# EAGLE design DAMAVA_0 (EAGLE 8.2.2)
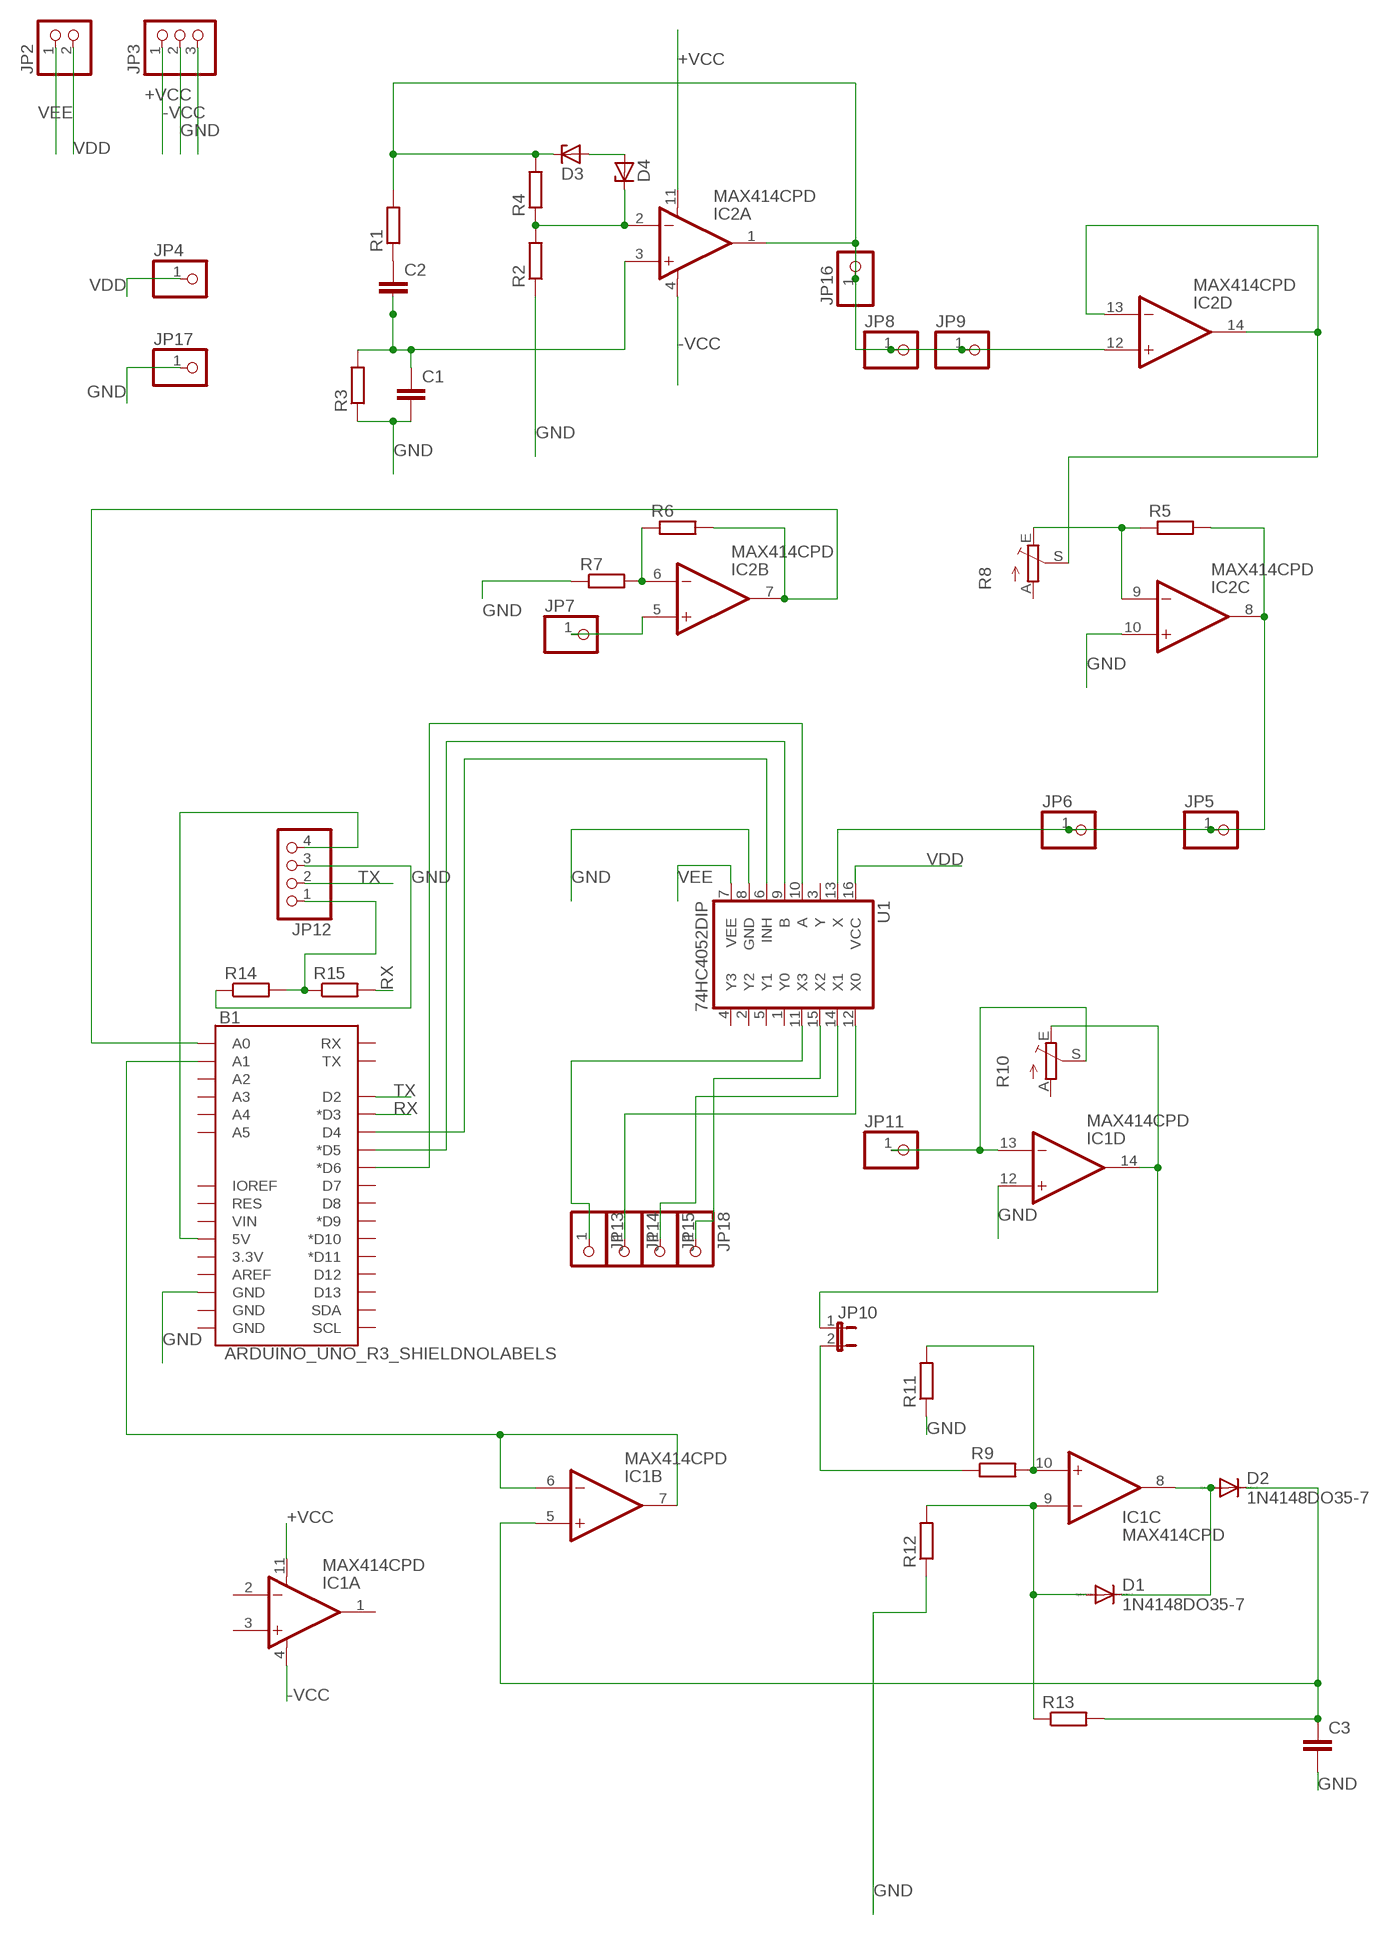
[diagram p0: schematic, sheet 1]

## Parts
B1  ARDUINO_UNO_R3_SHIELDNOLABELS  [UNO_R3_SHIELD_NOLABELS]
C1  C-EU025-024X044  [C025-024X044]
C2  C-EU025-024X044  [C025-024X044]
C3  C5/2.5  [C5B2.5]
D1  1N4148DO35-7  [DO35-7]
D2  1N4148DO35-7  [DO35-7]
D3  ZENER-DIODEZD-5  [ZDIO-5]
D4  ZENER-DIODEZD-5  [ZDIO-5]
IC1  MAX414CPD  [DIL14]
IC2  MAX414CPD  [DIL14]
JP2  PINHD-1X2  [1X02]
JP3  PINHD-1X3  [1X03]
JP4  PINHD-1X1  [1X01]
JP5  PINHD-1X1  [1X01]
JP6  PINHD-1X1  [1X01]
JP7  PINHD-1X1  [1X01]
JP8  PINHD-1X1  [1X01]
JP9  PINHD-1X1  [1X01]
JP10  JP1E  [JP1]
JP11  PINHD-1X1  [1X01]
JP12  PINHD-1X4  [1X04]
JP13  PINHD-1X1  [1X01]
JP14  PINHD-1X1  [1X01]
JP15  PINHD-1X1  [1X01]
JP16  PINHD-1X1  [1X01]
JP17  PINHD-1X1  [1X01]
JP18  PINHD-1X1  [1X01]
R1  R-EU_0204/5  [0204/5]
R2  R-EU_0204/5  [0204/5]
R3  R-EU_0204/5  [0204/5]
R4  R-EU_0204/5  [0204/5]
R5  R-EU_0204/5  [0204/5]
R6  R-EU_0204/5  [0204/5]
R7  R-EU_0204/5  [0204/5]
R8  TRIM_EU-B90P  [SP19L]
R9  R-EU_0204/5  [0204/5]
R10  TRIM_EU-B90P  [SP19L]
R11  R-EU_0204/5  [0204/5]
R12  R-EU_0204/5  [0204/5]
R13  R-EU_0204/5  [0204/5]
R14  R-EU_0204/5  [0204/5]
R15  R-EU_0204/5  [0204/5]
U1  74HC4052DIP  [DIL16]

## Nets
+VCC: IC1.11(A:V-) IC2.11(A:V-) JP3.1
-VCC: IC1.4(A:V+) IC2.4(A:V+) JP3.2
GND: B1.GND@2(GND) C1.2 C3.2 IC1.12(D:+IN) IC2.10(C:+IN) JP3.3 JP12.3 JP17.1 R2.1 R3.1 R7.1 R11.1 R12.1 R14.1 U1.8(GND)
N$1: C2.1 R1.1
N$2: C1.1 C2.2 IC2.3(A:+IN) R3.2
N$3: B1.D6(*D6) U1.10(A)
N$4: D4.C IC2.2(A:-IN) R2.2 R4.1
N$5: D3.C IC2.1(A:OUT) IC2.12(D:+IN) JP8.1 JP9.1 JP16.1 R1.2 R4.2
N$6: C3.1 D2.C IC1.5(B:+IN) R13.2
N$7: IC2.9(C:-IN) R5.1 R8.E
N$8: B1.D5(*D5) U1.9(B)
N$9: IC2.6(B:-IN) R6.1 R7.2
N$10: B1.A0 IC2.7(B:OUT) R6.2
N$11: IC2.5(B:+IN) JP7.1
N$12: B1.D4 U1.6(INH)
N$13: JP14.1 U1.12(X0)
N$14: JP15.1 U1.14(X1)
N$16: JP13.1 U1.11(X3)
N$17: IC1.13(D:-IN) JP11.1 R10.S
N$18: JP18.1 U1.15(X2)
N$19: B1.A1 IC1.6(B:-IN) IC1.7(B:OUT)
N$22: IC1.14(D:OUT) JP10.1 R10.E
N$23: IC1.10(C:+IN) R9.2 R11.2
N$24: JP10.2 R9.1
N$25: JP12.1 R14.2 R15.1
N$26: IC2.13(D:-IN) IC2.14(D:OUT) R8.S
N$28: D1.A IC1.9(C:-IN) R12.2 R13.1
N$29: D1.C D2.A IC1.8(C:OUT)
N$31: B1.5V JP12.4
N$33: IC2.8(C:OUT) JP5.1 JP6.1 R5.2 U1.13(X)
N$38: D3.A D4.A
RX: B1.D3(*D3) R15.2
TX: B1.D2 JP12.2
VDD: JP2.2 JP4.1 U1.16(VCC)
VEE: JP2.1 U1.7(VEE)
Unconnected: B1.3.3V B1.A2 B1.A3 B1.A4 B1.A5 B1.AREF B1.D7 B1.D8 B1.D9(*D9) B1.D10(*D10) B1.D11(*D11) B1.D12 B1.D13 B1.GND@0(GND) B1.GND@1(GND) B1.IOREF B1.RES B1.RX B1.SCL B1.SDA B1.TX B1.VIN IC1.1(A:OUT) IC1.2(A:-IN) IC1.3(A:+IN) R8.A R10.A U1.1(Y0) U1.2(Y2) U1.3(Y) U1.4(Y3) U1.5(Y1)

## Library data of the parts
B1 = SparkFun-Boards:ARDUINO_UNO_R3_SHIELD: Arduino R3 Shield Footprint Shield form compatible with the Arduino Uno R3. SparkFun Products: MG2639 Cellular Shield <https://www.sparkfun.com/products/13120> MIDI Shield <https://www.sparkfun.com/products/12898> R3 Stackable Headers Kit <https://www.sparkfun.com/products/11417>
C1 C2 = resistor:C-EU: CAPACITOR, European symbol
C3 = capacitor-wima:C: CAPACITOR naming: grid - package width
D1 D2 = diode:1N4148: DIODE high speed (Philips)
D3 D4 = diode:ZENER-DIODE: Z-Diode
IC1 IC2 = maxim:MAX414CPD: OP AMP; MPN: MAX414CPD+; OC_FARNELL: unknown; OC_NEWARK: 18M7422
JP2 = pinhead:PINHD-1X2: PIN HEADER
JP3 = pinhead:PINHD-1X3: PIN HEADER
JP4-JP9 JP11 JP13-JP18 = pinhead:PINHD-1X1: PIN HEADER
JP10 = jumper:JP1E: JUMPER
JP12 = pinhead:PINHD-1X4: PIN HEADER
R1-R7 R9 R11-R15 = resistor:R-EU_: RESISTOR, European symbol
R8 R10 = pot:TRIM_EU-: POTENTIOMETER
U1 = SparkFun-AnalogIC:74HC4052: Dual 4:1 analog mux

## Module MUX
Ports: 

### Library data of the parts

## Board
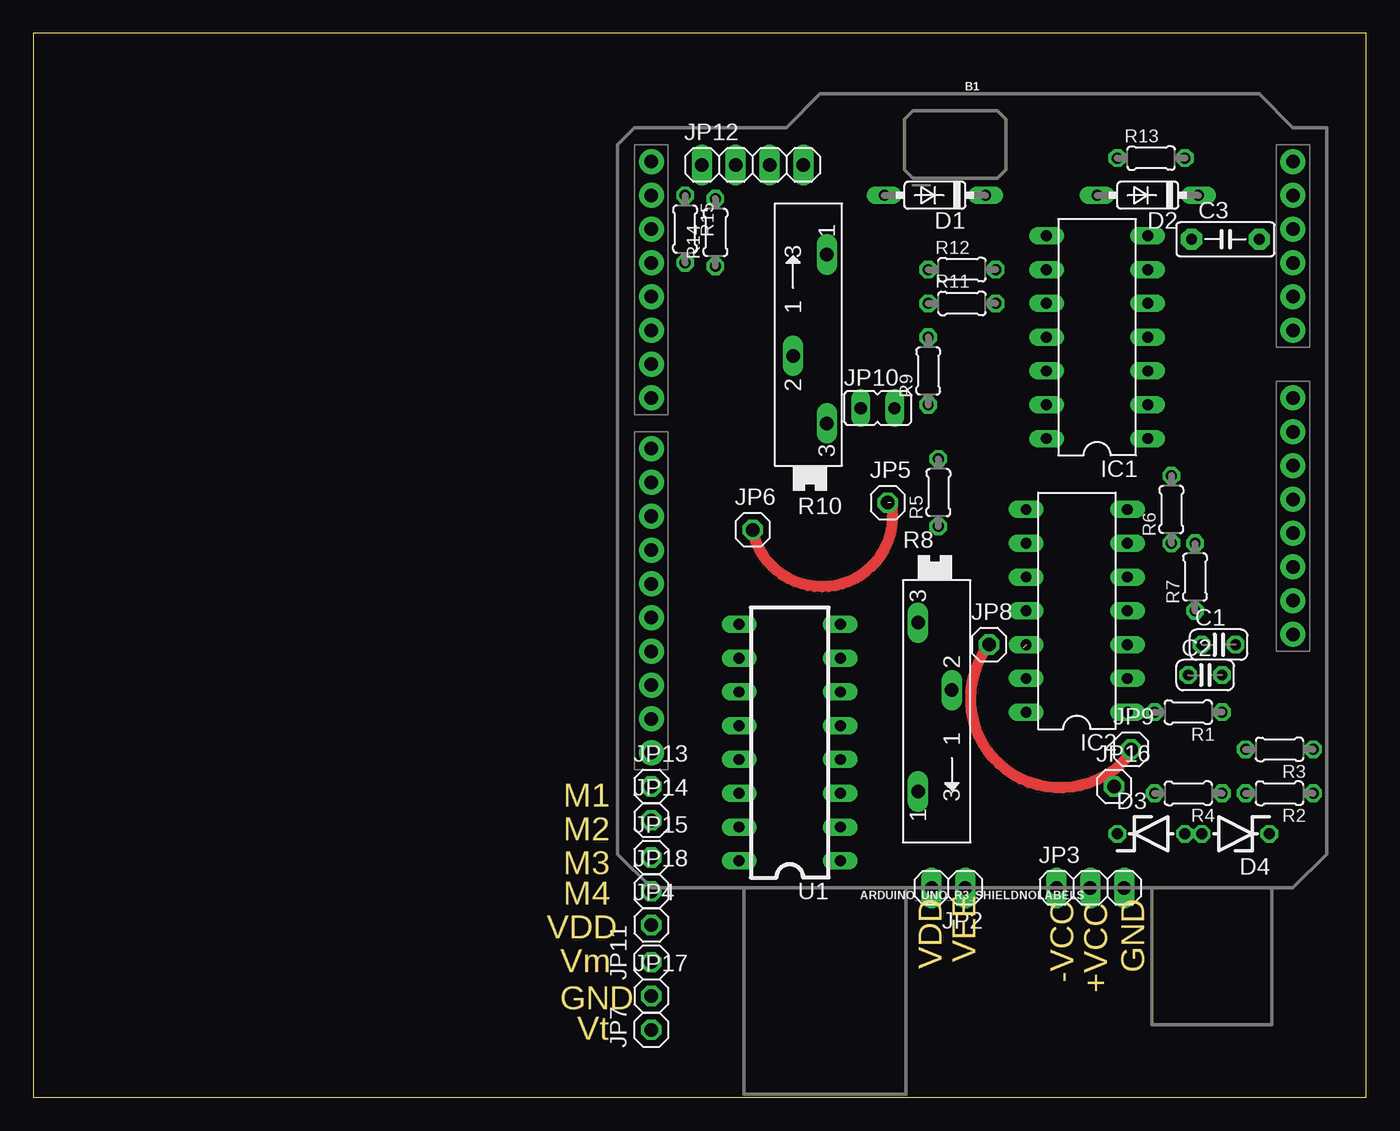
[diagram p1: board, top side]
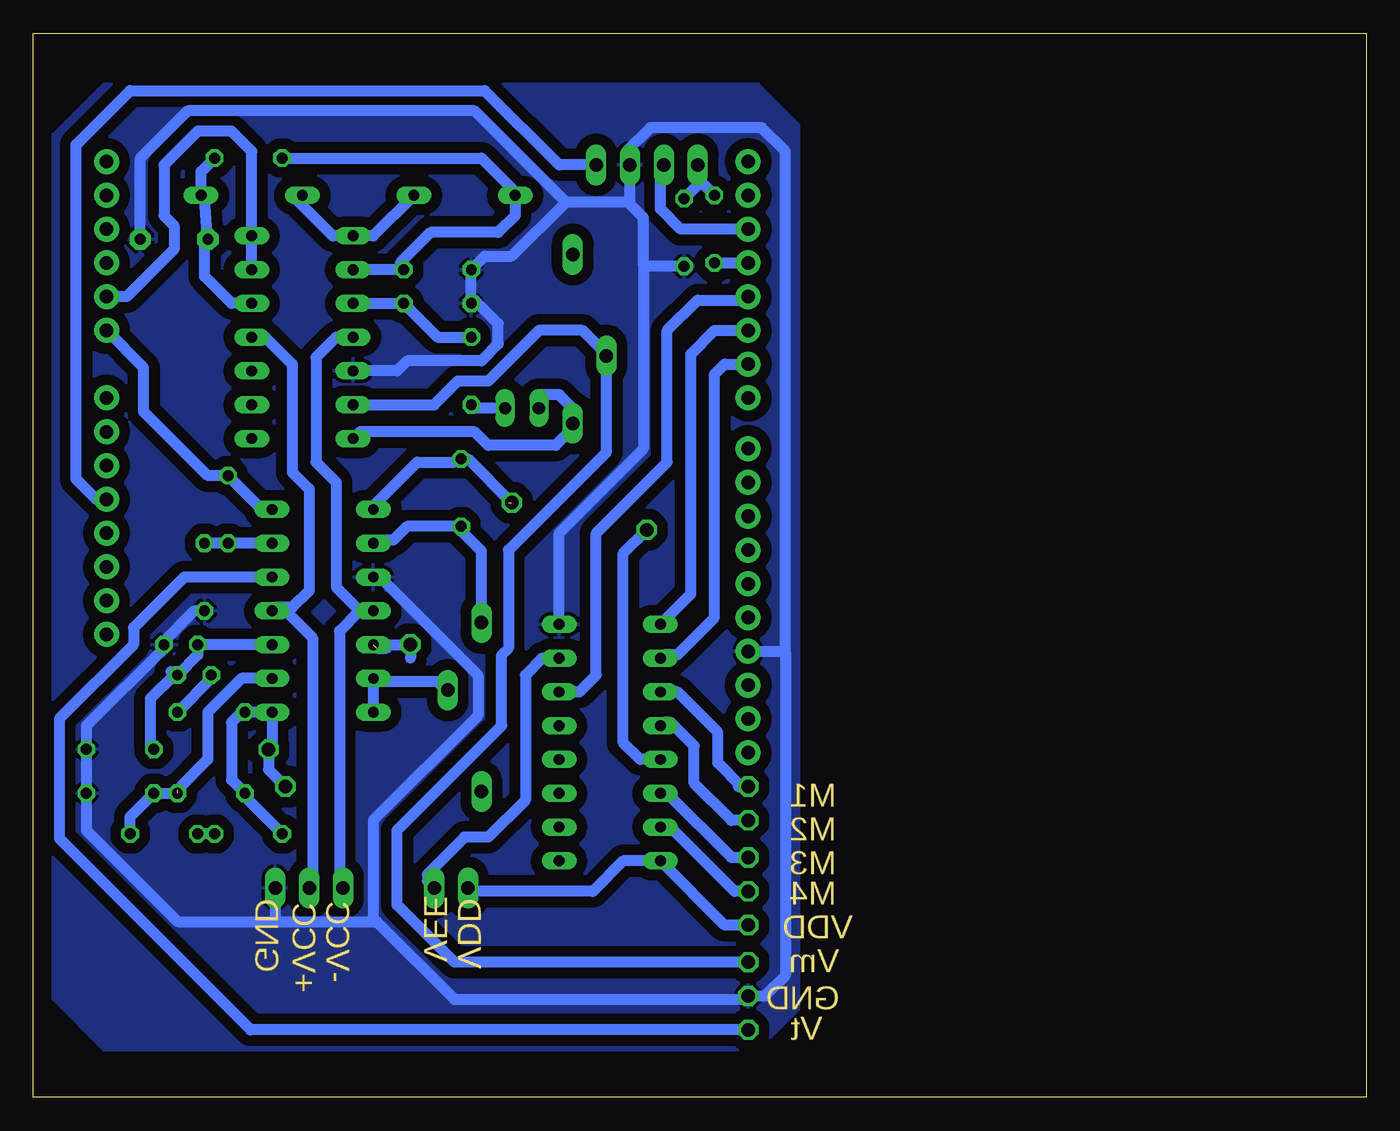
[diagram p2: board, bottom side, seen from below]

Size 100.25 x 80 mm. Coordinates in mm from the lower left corner, seen from the top.
Outline: 0,0 100.25,0 100.25,80 0,80 0,0
Copper layers (1*16): Top 0.035mm / dielectric 1.5mm / Bottom 0.035mm
Design rules "default": minimum track width 6mil, minimum drill 0.35mm, track to track 6mil, track to pad 6mil, pad to pad 6mil, via to via 6mil, smd to smd 6mil, copper to edge 40mil, drill to drill 6mil, minimum pad ring 10mil, minimum via ring 8mil, stop-mask expansion 4mil, vias tented up to drill 0mil, thermal gap 10mil

### Footprints (pad centres in the part's own frame; a part is rotated, then mirrored left to right if it is on the bottom)
UNO_R3_SHIELD_NOLABELS = drill 1.016 pad 1.88: 3.3V 24.13,-3.81; 5V 24.13,-1.27; A0 24.13,11.43; A1 24.13,13.97; A2 24.13,16.51; A3 24.13,19.05; A4 24.13,21.59; A5 24.13,24.13; AREF -24.13,-15.24; D2 -24.13,19.05; D3 -24.13,16.51; D4 -24.13,13.97; D5 -24.13,11.43; D6 -24.13,8.89; D7 -24.13,6.35; D8 -24.13,2.54; D9 -24.13,0; D10 -24.13,-2.54; D11 -24.13,-5.08; D12 -24.13,-7.62; D13 -24.13,-10.16; GND@0 24.13,1.27; GND@1 24.13,3.81; GND@2 -24.13,-12.7; IOREF 24.13,-8.89; NC 24.13,-11.43; RES 24.13,-6.35; RX -24.13,24.13; SCL -24.13,-20.32; SDA -24.13,-17.78; TX -24.13,21.59; VIN 24.13,6.35
C025-024X044 = drill 0.813 octagon: 1 -1.27,0; 2 1.27,0
C5B2.5 = drill 0.813 pad 1.6 octagon: 1 -2.54,0; 2 2.54,0
DO35-7 = drill 0.813 long: A 3.81,0; C -3.81,0
ZDIO-5 = drill 0.813 octagon: A 2.54,0; C -2.54,0
DIL14 = drill 0.813 long: 1 -7.62,-3.81; 2 -5.08,-3.81; 3 -2.54,-3.81; 4 0,-3.81; 5 2.54,-3.81; 6 5.08,-3.81; 7 7.62,-3.81; 8 7.62,3.81; 9 5.08,3.81; 10 2.54,3.81; 11 0,3.81; 12 -2.54,3.81; 13 -5.08,3.81; 14 -7.62,3.81
1X02 = drill 1.016 long: 1 -1.27,0; 2 1.27,0
1X03 = drill 1.016 long: 1 -2.54,0; 2 0,0; 3 2.54,0
1X01 = drill 1.016 octagon: 1 0,0
JP1 = drill 0.914 long: 1 0,-1.27; 2 0,1.27
1X04 = drill 1.016 long: 1 -3.81,0; 2 -1.27,0; 3 1.27,0; 4 3.81,0
0204/5 = drill 0.813 octagon: 1 -2.54,0; 2 2.54,0
SP19L = drill 1.016 long: A 5.715,-1.27; E -6.985,-1.27; S -1.905,1.27
DIL16 = drill 0.813 long: 1 -8.89,-3.81; 2 -6.35,-3.81; 3 -3.81,-3.81; 4 -1.27,-3.81; 5 1.27,-3.81; 6 3.81,-3.81; 7 6.35,-3.81; 8 8.89,-3.81; 9 8.89,3.81; 10 6.35,3.81; 11 3.81,3.81; 12 1.27,3.81; 13 -1.27,3.81; 14 -3.81,3.81; 15 -6.35,3.81; 16 -8.89,3.81

### Placement (x,y rotation side)
B1  70.61,46.23 0 top
C1  89.15,34.04 0 top
C2  88.14,31.75 0 top
C3  89.66,64.52 0 top
D1  67.82,67.82 180 top
D2  83.82,67.82 180 top
D3  84.07,19.81 0 top
D4  90.42,19.81 180 top
IC1  80.01,57.15 90 top
IC2  78.49,36.58 90 top
JP2  68.83,15.75 180 top
JP3  79.5,15.75 0 top
JP4  46.48,12.95 0 top
JP5  64.26,44.7 0 top
JP6  54.1,42.67 0 top
JP7  46.48,5.08 90 top
JP8  71.88,34.04 0 top
JP9  82.55,26.16 0 top
JP10  63.5,51.82 270 top
JP11  46.48,10.16 90 top
JP12  54.1,70.1 0 top
JP13  46.48,23.37 0 top
JP14  46.48,20.83 0 top
JP15  46.48,18.03 0 top
JP16  81.28,23.37 0 top
JP17  46.48,7.62 0 top
JP18  46.48,15.49 0 top
R1  86.87,28.96 180 top
R2  93.73,22.86 180 top
R3  93.73,26.16 180 top
R4  86.87,22.86 180 top
R5  68.07,45.47 90 top
R6  85.6,44.2 90 top
R7  87.38,39.12 90 top
R8  67.82,28.7 270 top
R9  67.31,54.61 90 top
R10  58.42,57.66 90 top
R11  69.85,59.69 0 top
R12  69.85,62.23 0 top
R13  84.07,70.61 0 top
R14  51.31,65.02 90 top
R15  49.02,65.28 270 top
U1  56.9,26.67 90 top

### Tracks (layer width: path | path; a pad name or v marks a point on that pad's centre or on a via)
+VCC
  Bottom 0.813: 75.69,36.58 IC2.11 | 75.69,36.58 77.22,35.05 77.22,16.51 76.71,16 JP3.1 | IC1.11 77.47,57.15 78.99,55.63 78.99,47.75 77.47,46.23 77.47,38.35 75.69,36.58
-VCC
  Bottom 0.813: IC1.4 82.8,57.15 80.77,55.12 80.77,46.99 79.5,45.72 79.5,38.1 80.77,36.83 82.04,36.83 IC2.4 81.28,36.58 79.25,34.54 79.25,16 JP3.2
GND
  Bottom 0.813: R11.1 67.31,59.94 | 67.31,59.94 R12.1 66.29,63.25 64.26,63.25 60.2,67.31 | 67.31,59.94 67.06,59.94 65.28,58.17 65.28,56.64 66.55,55.37 72.14,55.37 72.9,54.61 IC1.12 | 60.45,35.81 U1.8 60.71,42.42 54.36,48.77 54.36,62.61 | 43.69,33.48 43.69,9.14 45.21,7.62 JP17.1 46.74,7.37 68.58,7.37 74.42,13.21 82.09,13.21 | 43.69,33.48 43.69,71.12 45.47,72.9 53.85,72.9 55.63,71.12 55.63,70.36 JP12.3 55.37,67.47 55.53,67.31 | IC2.10 74.17,39.12 66.8,31.75 66.8,28.7 74.68,20.83 74.68,13.46 74.93,13.21 | C3.2 92.2,70.61 88.65,74.17 67.06,74.17 60.2,67.31 | B1.GND@2 43.73,33.53 43.69,33.48 | R7.1 88.14,36.58 90.68,34.04 C1.2 90.42,33.78 96.27,27.94 R3.1 R2.1 96.27,20.07 89.41,13.21 82.09,13.21 | JP3.3 82.04,13.26 82.09,13.21 | 55.53,67.31 60.2,67.31 | 55.53,67.31 54.36,66.14 54.36,62.61 | R14.1 54.23,62.48 54.36,62.61
  pour Bottom (isolate 0.813): 42.67,27.94 42.67,6.6 45.72,3.56 95,3.56 98.81,7.37 98.81,72.39 95,76.2 45.72,76.2 42.67,73.15
N$1
  Bottom 0.813: C2.1 86.87,31.5 R1.1
N$2
  Bottom 0.813: IC2.3 C1.1 87.88,33.27 C2.2 | 91.19,26.42 R3.2 91.44,26.42 91.44,29.97 89.66,31.75 C2.2 | 89.92,32 C2.2
N$3
  Bottom 0.813: U1.10 52.83,33.27 51.82,33.27 49.02,36.07 49.02,54.36 48.26,55.12 B1.D6
N$4  (1 unrouted)
  Bottom 0.813: 89.41,23.11 87.12,25.4 87.12,28.96 84.58,31.5 IC2.2 | R4.1 R2.2 92.96,21.08 D4.C
N$5  (via drill 0.35)  (1 unrouted)
  Top 0.813: v82.55,25.91 arc-180 JP8.1
  Bottom 0.813: 84.58,28.96 84.62,28.96 84.62,28.92 | 74.42,33.78 73.66,33.78 | 71.88,33.02 JP8.1 IC2.12 | D3.C 84.33,22.61 R4.2 85.34,23.88 85.34,28.19 84.58,28.96 | JP16.1 82.55,24.64 v82.55,25.91 JP9.1 82.3,26.42 IC2.1 R1.2 84.58,28.96
N$6
  Bottom 0.813: 87.15,64.9 87.38,67.56 D2.C 87.63,69.6 R13.2 | 87.15,64.9 C3.1 | 84.58,59.69 IC1.5 85.34,59.69 87.38,61.72 87.38,64.68 87.15,64.9
N$7
  Bottom 0.813: IC2.9 74.42,41.91 73.15,41.91 72.14,42.93 68.4,42.93 | 68.4,42.93 R5.1 | R8.E 66.55,41.07 68.4,42.93
N$8
  Bottom 0.813: U1.9 50.8,37.85 50.8,55.88 49.02,57.66 B1.D5
N$9
  Bottom 0.813: 85.6,41.91 R6.1 | IC2.6 R6.1 | R6.1 R7.2
N$10
  Bottom 0.813: IC2.7 83.06,44.2 R6.2 87.12,46.74 91.95,51.56 91.95,54.86 B1.A0
N$11
  Bottom 0.813: IC2.5 88.9,39.12 92.71,35.31 92.71,34.04 98.3,28.45 98.3,19.47 83.91,5.08 JP7.1
N$12
  Bottom 0.813: 59.44,30.48 U1.6 59.18,30.48 57.91,31.75 57.91,42.42 52.58,47.75 52.58,57.66 50.29,59.94 46.74,59.94 B1.D4
N$13
  Bottom 0.813: U1.12 52.83,28.19 52.32,28.19 50.55,26.42 50.55,23.62 47.75,20.83 JP14.1
N$14
  Bottom 0.813: U1.14 52.58,22.86 47.75,18.03 JP15.1
N$16
  Bottom 0.813: 47.24,23.37 46.99,23.37 | JP13.1 46.99,23.37 | 46.99,23.37 48.77,25.15 48.77,27.43 51.82,30.48 U1.11
N$17
  Bottom 0.813: IC1.13 70.1,52.07 68.33,53.85 66.04,53.85 62.23,57.66 58.93,57.66 57.15,55.88 R10.S 57.15,48.51 64.52,41.15 64.52,33.78 65.02,33.27 65.02,27.94 72.9,20.07 72.9,14.48 68.58,10.16 JP11.1
N$18
  Bottom 0.813: U1.15 52.32,20.32 47.5,15.49 JP18.1
N$19
  Bottom 0.813: IC1.6 IC1.7 83.82,71.12 85.34,72.64 87.88,72.64 90.42,70.1 90.42,66.29 89.66,65.53 89.66,63.75 93.22,60.2 B1.A1 | B1.A1 94.23,60.2 | 94.49,59.69 94.74,59.69 B1.A1
N$22
  Bottom 0.813: IC1.14 75.69,50.04 67.06,50.04 66.04,49.02 60.96,49.02 59.69,50.29 R10.E 59.69,51.82 60.71,52.83 62.23,52.83 JP10.1
N$23
  Bottom 0.813: R9.2 69.85,57.15 R11.2 IC1.10
N$24
  Bottom 0.813: JP10.2 67.06,51.82 R9.1
N$25
  Bottom 0.813: R15.1 50.29,69.09 JP12.1 50.29,68.58 R14.2
N$26
  Bottom 0.813: 74.66,28.96 IC2.14 IC2.13 74.42,31.24 69.85,31.24 69.22,30.61 R8.S 69.22,30.73
N$28
  Bottom 0.813: R12.2 72.39,62.48 72.64,62.23 | 72.64,62.23 IC1.9 | R13.1 66.55,70.61 64.01,68.07 D1.A 64.01,66.29 65.28,65.02 70.36,65.02 72.64,62.74 72.64,62.23
N$29
  Bottom 0.813: 72.39,67.82 D1.C 74.68,64.77 IC1.8 77.72,64.77 80.52,67.56 80.26,67.56 D2.A
N$31
  Bottom 0.813: JP12.4 60.71,70.1 66.29,75.69 92.96,75.69 97.03,71.63 97.03,46.48 95.5,44.96 B1.5V
N$33  (1 unrouted)
  Top 0.813: 64.52,44.7 arc-180 JP6.1
  Bottom 0.813: 64.26,44.96 JP5.1 67.56,48.01 R5.2 | R5.2 68.33,48.01 68.58,47.75 71.37,47.75 74.68,44.45 IC2.8 74.42,44.45 | 68.07,47.75 R5.2 | U1.13 54.61,25.4 55.88,26.67 55.88,40.89 JP6.1
N$38
  Bottom 0.813: D3.A D4.A
RX
  Bottom 0.813: R15.2 B1.D3
TX
  Bottom 0.813: B1.D2 51.56,65.28 53.09,66.8 53.09,69.85 JP12.2
VDD
  Bottom 0.813: 67.56,15.24 67.82,15.49 JP2.2 67.31,15.49 58.17,15.49 55.88,17.78 U1.16 48.26,12.95 JP4.1
VEE
  Bottom 0.813: U1.7 61.98,33.02 63.25,31.75 63.25,22.35 66.04,19.56 67.82,19.56 70.61,16.76 70.61,16.26 JP2.1

### Text on the board
Milling: M1 | M2 | M3 | M4 | VDD | VDD | VEE | Vm | -VCC | GND | +VCC | GND | Vt